# Altium project Cuttomized_Industrial_controller.PrjPcb
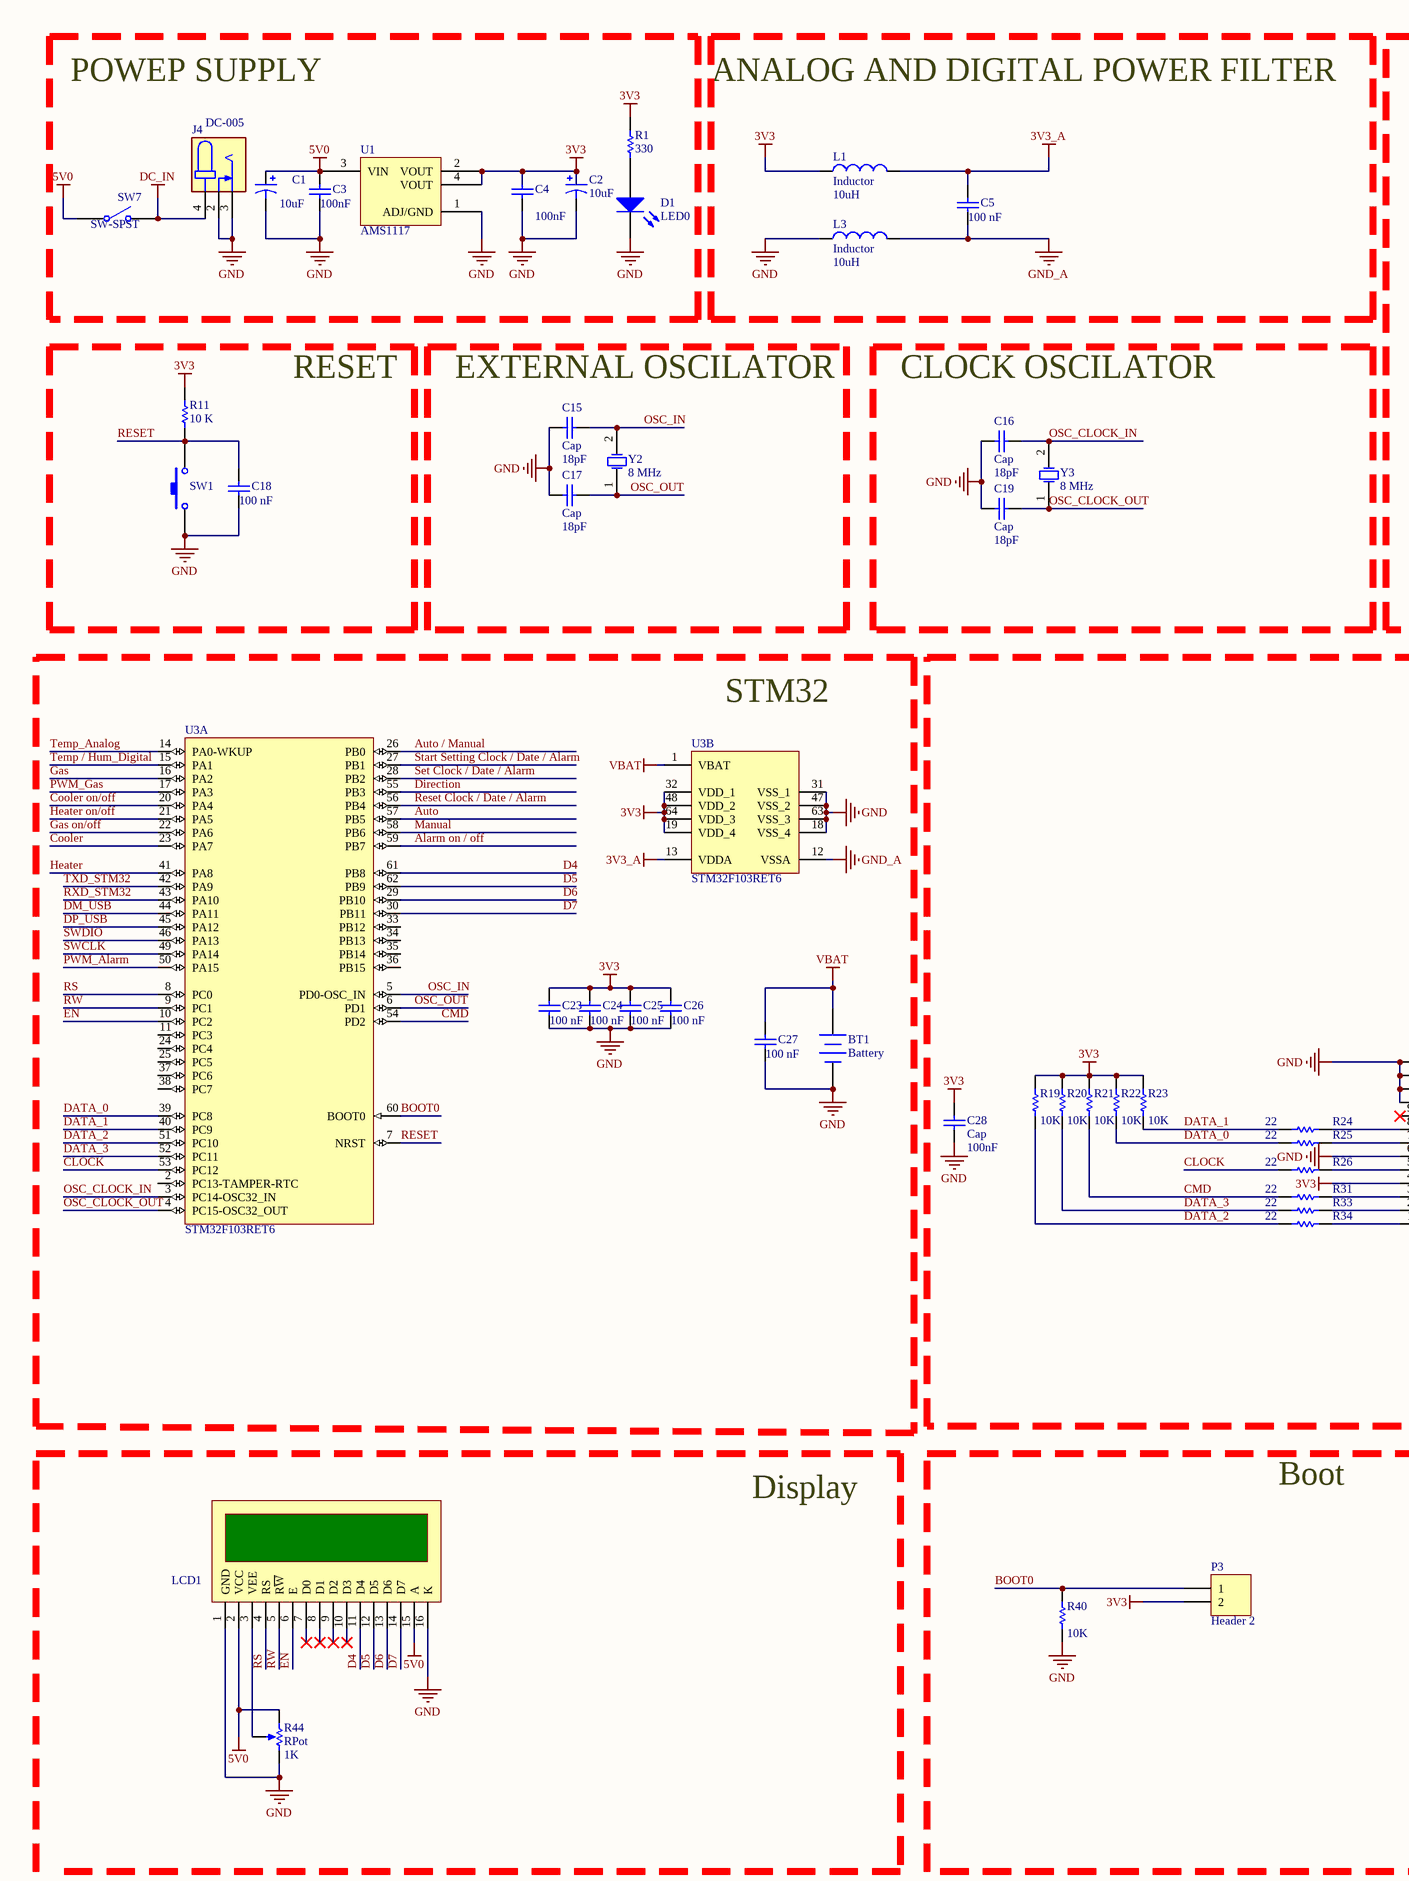
[diagram p0: Cuttomized_Industrial_controller.SchDoc, left]
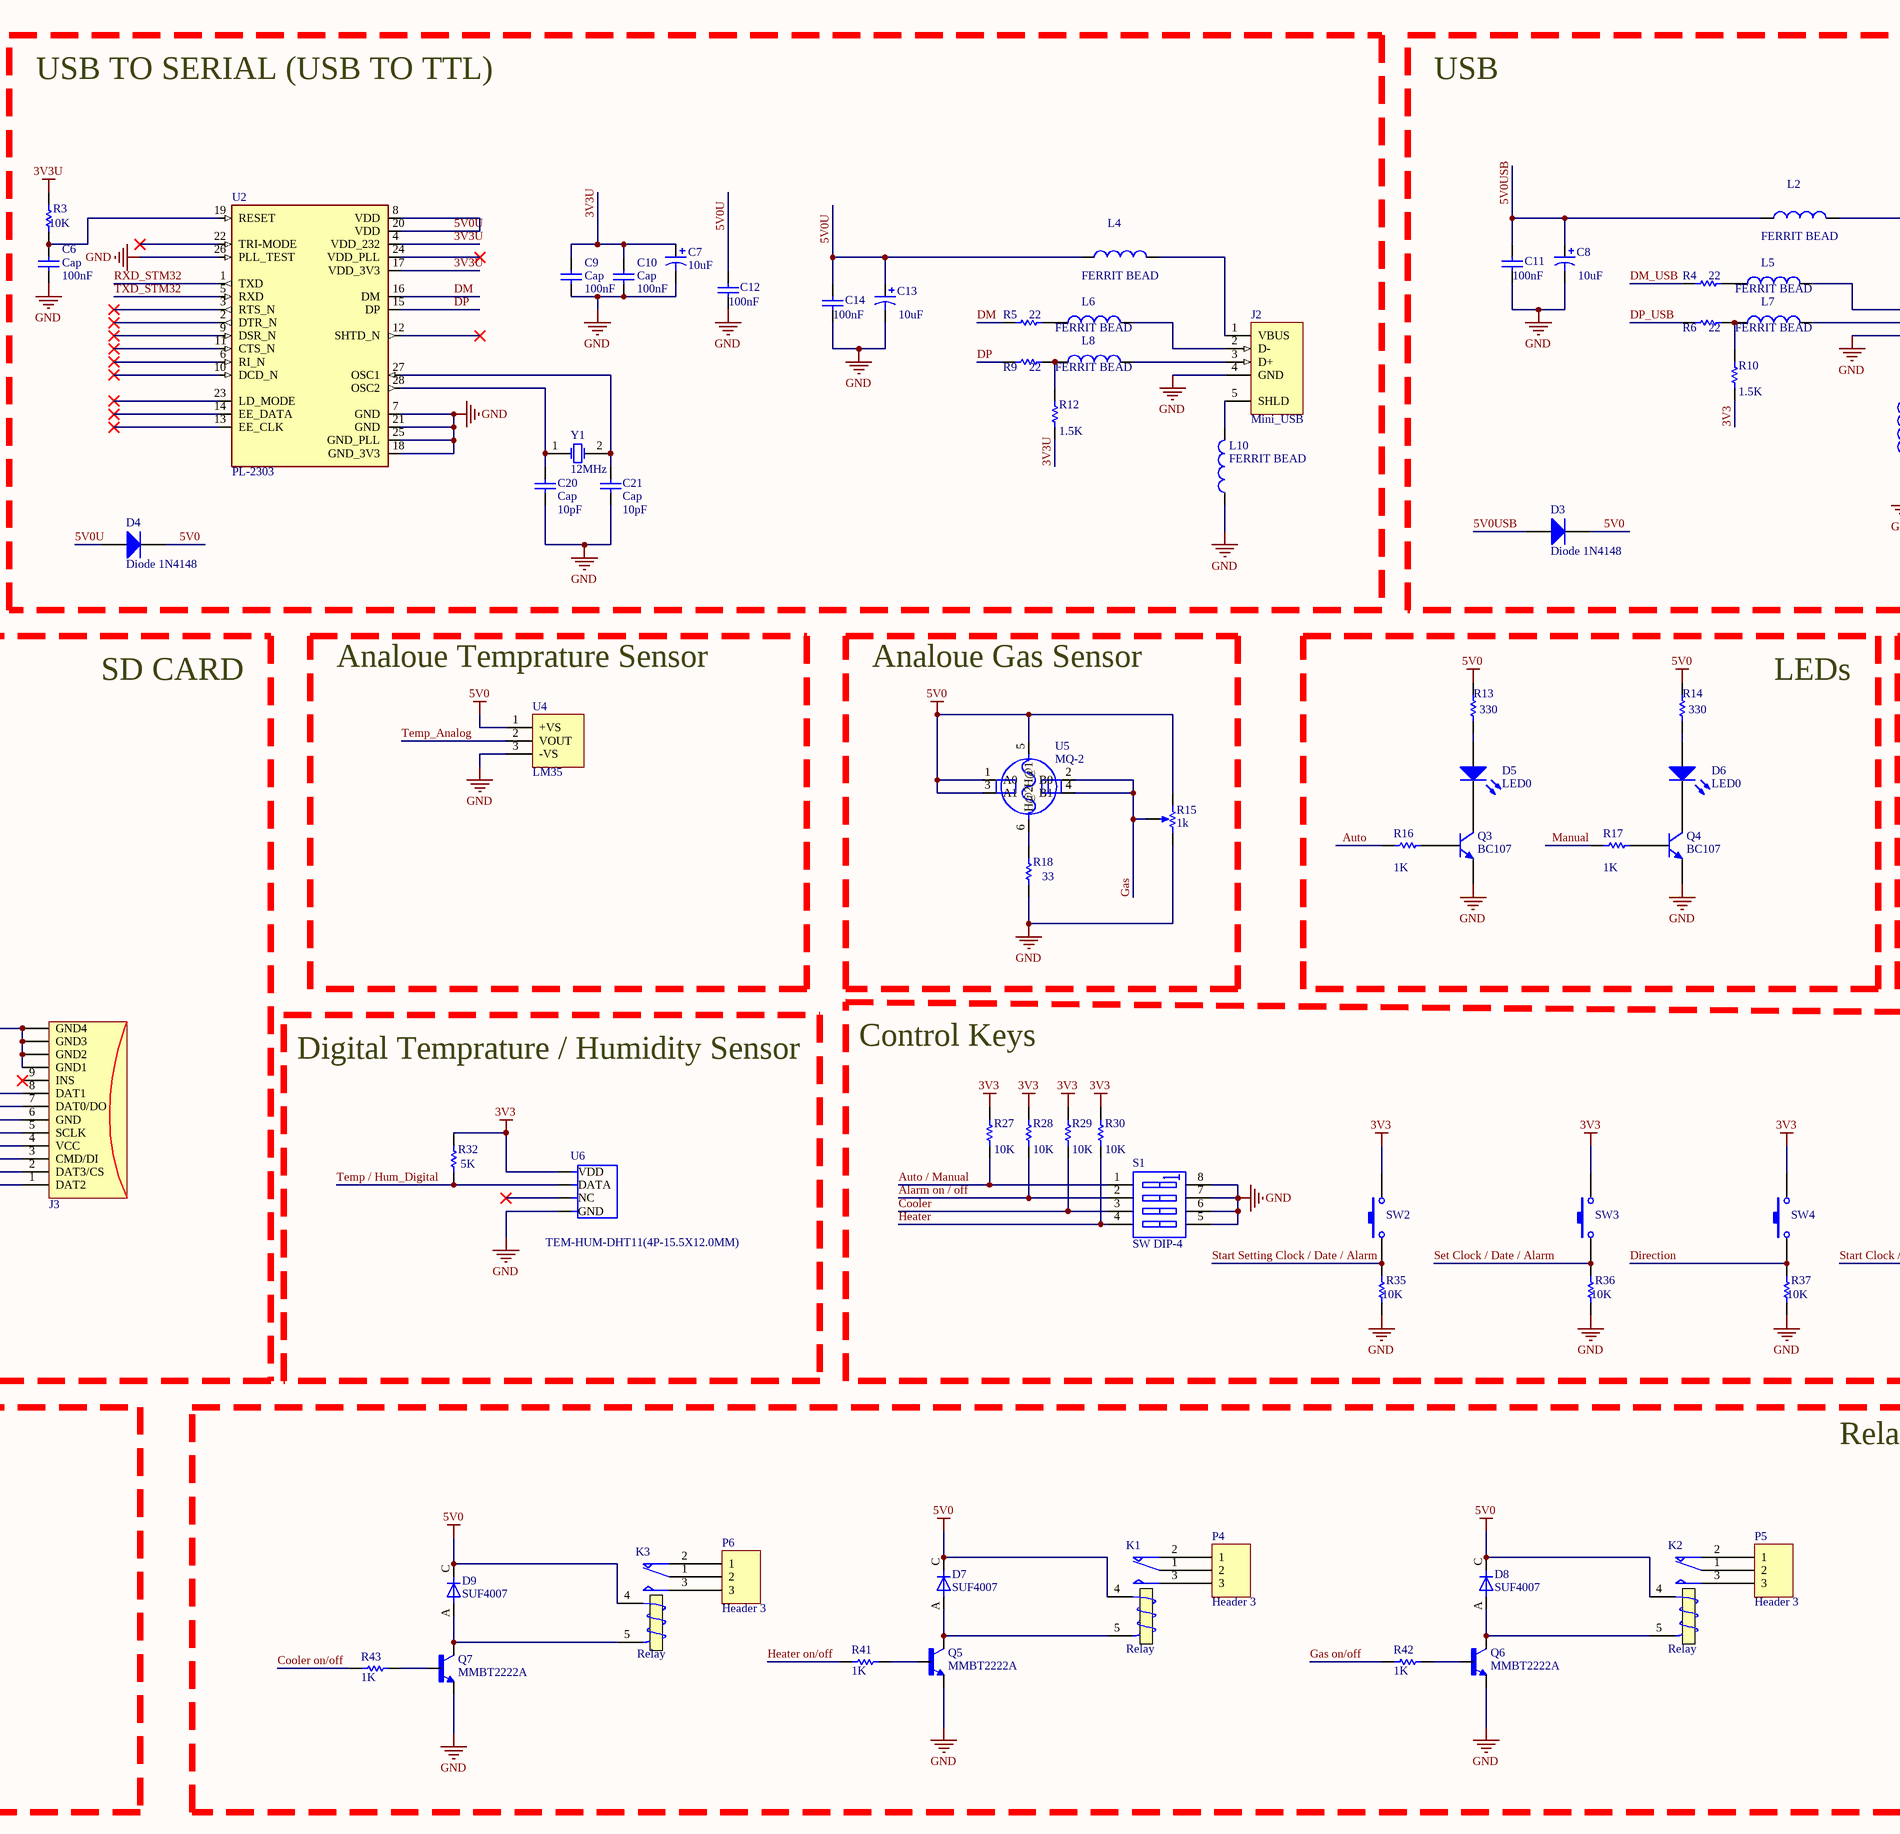
[diagram p1: Cuttomized_Industrial_controller.SchDoc, middle]
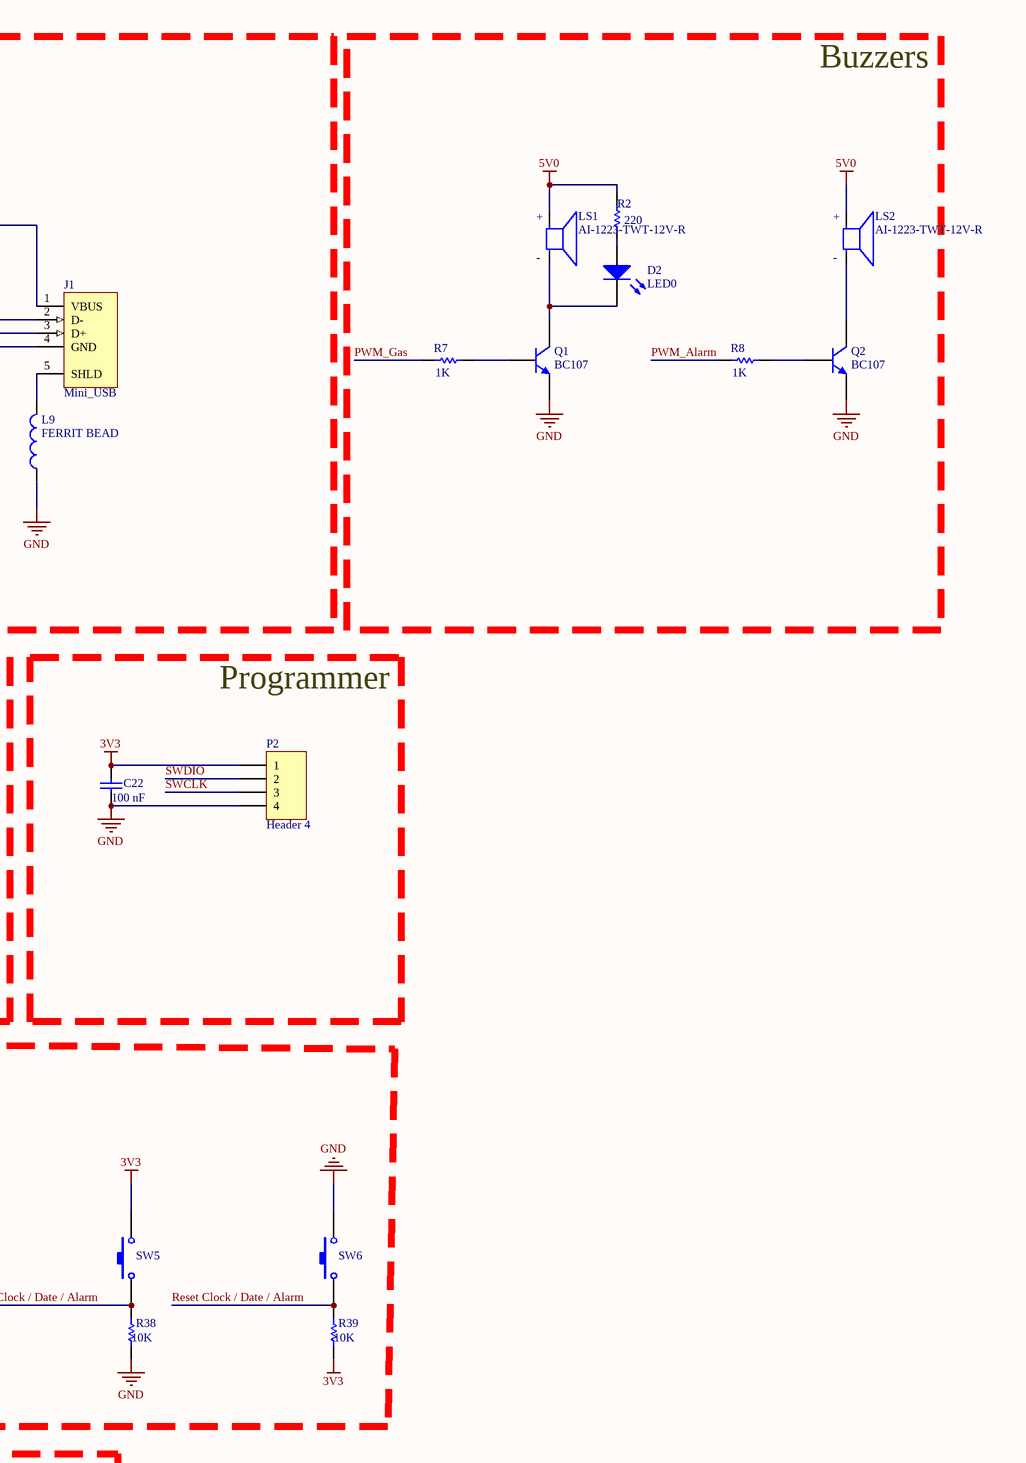
[diagram p2: Cuttomized_Industrial_controller.SchDoc, right]
1 sheet, 131 parts. Net scope: global (net labels, ports and power ports of the same name join across sheets).
Board file: Cuttomized_Industrial_controller.PcbDoc

## Sheet Cuttomized_Industrial_controller.SchDoc
size D; SheetNumber: 1; SheetTotal: 1; SPICEModelCacheBRBSMZFC: <root> / <DocumentId>BRBSMZFC</DocumentId> / <CacheFrame Number="0"> / <Model Name="spdtrelay" Kind="CKT"> / <Text>*Generic SPDT Relay / *Connections:     COM / *                 | NC / *                 | | NO / *                 | | | T1 / *                 | | | | T2 / *                 | | | | | / .SUBCKT SPDTRELAY 1 2 3 4 5 / + PARAMS: PULLIN=4 DROPOFF=0.1 CONTACT=1m RESISTANCE=500 INDUCTANCE=10m / L1 4 6 {(INDUCTANCE/2)} / L2 5 7 {(INDUCTANCE/2)} / R1 6 7 {RESISTANCE} / BNO 8 0 V={PULLIN}-abs(v(6,7)) / SW1 2 1 8 0 SWNC ON / BNC 9 0 V=abs(v(6,7)) / SW2 3 1 9 0 SWNO OFF / .MODEL SWNC SW(VT={DROPOFF} RON={CONTACT} ) / .MODEL SWNO SW(VT={(PULLIN*0.98)} RON={CONTACT} ) / .ENDS SPDTRELAY</Text> / </Model> / <Model Name="dpsw4" Kind="CKT"> / <Text>* DIP switch 4 / * jjt 20/6/2002: created / * / *             Switch connections: / *             sw1 / *             |  |  sw2 / *             |  |  |  |  sw3 / *             |  |  |  |  |  |   sw4 / *             |  |  |  |  |  |  |   | / *             |  |  |  |  |  |  |   | / .subckt dpsw4 1  2  4  5  7  8  10  11 / + PARAMS: STATE1=0 STATE2=0 STATE3=0 STATE4=0 RON=1m ROFF=100E6 / * / V1 3  0 {STATE1} / V2 6  0 {STATE2} / V3 9  0 {STATE3} / V4 12 0 {STATE4} / * / SDIP1 1  2  3  0 DIPMOD / SDIP2 4  5  6  0 DIPMOD / SDIP3 7  8  9  0 DIPMOD / SDIP4 10 11 12 0 DIPMOD / * / .MODEL DIPMOD SW(VT=0.5 RON={RON} ROFF={ROFF}) / .ends dpsw4</Text> / </Model> / </CacheFrame> / </root>

### Parts
BT1  Battery  [BAT-2]
C1  10uF  [CAP_tantal]
C2  10uF  [CAP_tantal]
C3  value 100nF  [C0805]
C4  value 100nF  [C0805]
C5  value 100 nF  [C0805]
C6  Cap  value 100nF  [C0805]
C7  10uF  [CAP_tantal]
C8  10uF  [CAP_tantal]
C9  Cap  value 100nF  [C0805]
C10  Cap  value 100nF  [C0805]
C11  value 100nF  [C0805]
C12  value 100nF  [C0805]
C13  10uF  [CAP_tantal]
C14  value 100nF  [C0805]
C15  Cap  value 18pF  [C0805]
C16  Cap  value 18pF  [C0805]
C17  Cap  value 18pF  [C0805]
C18  value 100 nF  [C0805]
C19  Cap  value 18pF  [C0805]
C20  Cap  value 10pF  [C0805]
C21  Cap  value 10pF  [C0805]
C22  value 100 nF  [C0805]
C23  value 100 nF  [C0805]
C24  value 100 nF  [C0805]
C25  value 100 nF  [C0805]
C26  value 100 nF  [C0805]
C27  value 100 nF  [C0805]
C28  Cap  value 100nF  [C0805]
D1  LED0  [C0805]
D2  LED0  [C0805]
D3  Diode 1N4148  [SOD-123]
D4  Diode 1N4148  [SOD-123]
D5  LED0  [C0805]
D6  LED0  [C0805]
D7  SUF4007  [DIOMELF5025N]
D8  SUF4007  [DIOMELF5025N]
D9  SUF4007  [DIOMELF5025N]
J1  Mini_USB  [USB_mini]
J2  Mini_USB  [USB_mini]
J3  MMC-uSD  [SD-MicroSD_1]  (value not drawn)
J4  DC-005  [NINIGI_DC-005]
K1  Relay  [Relay 5A]
K2  Relay  [Relay 5A]
K3  Relay  [Relay 5A]
L1  Inductor  value 10uH  [C0805]
L2  FERRIT BEAD  [C0805]
L3  Inductor  value 10uH  [C0805]
L4  FERRIT BEAD  [C0805]
L5  FERRIT BEAD  [C0805]
L6  FERRIT BEAD  [C0805]
L7  FERRIT BEAD  [C0805]
L8  FERRIT BEAD  [C0805]
L9  FERRIT BEAD  [C0805]
L10  FERRIT BEAD  [C0805]
LCD1  LCD2x16  [LCD 2*16]  (value not drawn)
LS1  AI-1223-TWT-12V-R  [XDCR_AI-1223-TWT-12V-R]
LS2  AI-1223-TWT-12V-R  [XDCR_AI-1223-TWT-12V-R]
P2  Header 4  [HDR1X4]
P3  Header 2  [HDR1X2]
P4  Header 3  [phoenix terminal 3]
P5  Header 3  [phoenix terminal 3]
P6  Header 3  [phoenix terminal 3]
Q1  BC107  [SOT23]
Q2  BC107  [SOT23]
Q3  BC107  [SOT23]
Q4  BC107  [SOT23]
Q5  MMBT2222A  [SOT23]
Q6  MMBT2222A  [SOT23]
Q7  MMBT2222A  [SOT23]
R1  330  [C0805]
R2  value 220  [C0805]
R3  value 10K  [C0805]
R4  value 22  [C0805]
R5  value 22  [C0805]
R6  value 22  [C0805]
R7  value 1K  [C0805]
R8  value 1K  [C0805]
R9  value 22  [C0805]
R10  value 1.5K  [C0805]
R11  10 K  [C0805]
R12  value 1.5K  [C0805]
R13  value 330  [C0805]
R14  value 330  [C0805]
R15  1k  [Multi-Turn]
R16  value 1K  [C0805]
R17  value 1K  [C0805]
R18  value 33  [C0805]
R19  value 10K  [C0805]
R20  value 10K  [C0805]
R21  value 10K  [C0805]
R22  value 10K  [C0805]
R23  value 10K  [C0805]
R24  value 22  [C0805]
R25  value 22  [C0805]
R26  value 22  [C0805]
R27  value 10K  [C0805]
R28  value 10K  [C0805]
R29  value 10K  [C0805]
R30  value 10K  [C0805]
R31  value 22  [C0805]
R32  value 5K  [C0805]
R33  value 22  [C0805]
R34  value 22  [C0805]
R35  value 10K  [C0805]
R36  value 10K  [C0805]
R37  value 10K  [C0805]
R38  value 10K  [C0805]
R39  value 10K  [C0805]
R40  value 10K  [C0805]
R41  value 1K  [C0805]
R42  value 1K  [C0805]
R43  value 1K  [C0805]
R44  RPot  value 1K  [Multi-Turn]
S1  SW DIP-4  [dip switch x4]
SW1  ?  [Sw_Tact 2PIN]  (value not drawn)
SW2  ?  [Sw_Tact 2PIN]  (value not drawn)
SW3  ?  [Sw_Tact 2PIN]  (value not drawn)
SW4  ?  [Sw_Tact 2PIN]  (value not drawn)
SW5  ?  [Sw_Tact 2PIN]  (value not drawn)
SW6  ?  [Sw_Tact 2PIN]  (value not drawn)
SW7  SW-SPST  [DSW 1]
U1  AMS1117  [SOT223_L]
U2  PL-2303  [SOP65P780X200-28N]
U3  STM32F103RET6  [LQFP64]  (parts A,B of 2)
U4  LM35  [TO-92]
U5  MQ-2  [SNR6-D19.0MM]
U6  TEM-HUM-DHT11(4P-15.5X12.0MM)  [SNR4-2.54-15.5X12.0X5.5MM]
Y1  12MHz  [Xtal]
Y2  8 MHz  [Xtal]
Y3  8 MHz  [Xtal]

### Blocks framed on the sheet
POWEP SUPPLY: C1-C4 D1 J4 R1 SW7 U1
ANALOG AND DIGITAL POWER FILTER: C5 L1 L3
USB TO SERIAL (USB TO TTL): C6 C7 C9 C10 C12-C14 C20 C21 D4 J2 L4 L6 L8 L10 R3 R5 R9 R12 U2 Y1
USB: C8 C11 D3 J1 L2 L5 L7 L9 R4 R6 R10
Buzzers: D2 LS1 LS2 Q1 Q2 R2 R7 R8
RESET: C18 R11 SW1
EXTERNAL OSCILATOR: C15 C17 Y2
CLOCK OSCILATOR: C16 C19 Y3
STM32: BT1 C23-C27 U3
SD CARD: C28 J3 R19-R26 R31 R33 R34
Analoue Gas Sensor: R15 R18 U5
LEDs: D5 D6 Q3 Q4 R13 R14 R16 R17
Programmer: C22 P2
Digital Temprature / Humidity Sensor: R32 U6
Control Keys: R27-R30 R35-R39 S1 SW2-SW6
Boot: P3 R40
Relays: D7-D9 K1-K3 P4-P6 Q5-Q7 R41-R43

### Nets
3V3: C2.2 C4.2 C22.2 C23.2 C24.2 C25.2 C26.2 C28.2 J3.4(VCC) L1.1 P2.1 P3.2 R1.2 R10.2 R11.2 R19.1 R20.1 R21.1 R22.1 R23.1 R27.1 R28.1 R29.1 R30.1 R32.2 R39.2 SW2.2 SW3.2 SW4.2 SW5.2 U1.2(VOUT) U1.4(VOUT) U3.19(VDD_4) U3.32(VDD_1) U3.48(VDD_2) U3.64(VDD_3) U6.1(VDD)
3V3_A: C5.2 L1.2 U3.13(VDDA)
3V3U: C7.2 C9.2 C10.2 R3.1 R12.2 U2.4(VDD_232) U2.17(VDD_3V3)
5V0: C1.2 C3.2 D3.2(K) D4.2(K) D7.C D8.C D9.C K1.4(T1) K2.4(T1) K3.4(T1) LCD1.2(VCC) LCD1.15(A) LS1.P(POS) LS2.P(POS) R2.1 R13.1 R14.1 R15.1(TOP) R44.1(TOP) SW7.1(COMMON) U1.3(VIN) U4.1(+VS) U5.1(A0) U5.3(A1) U5.5(H@1)
DC_IN: J4.4 SW7.2(NO)
GND: BT1.2(-) C1.1 C2.1 C3.1 C4.1 C6.1 C7.1 C8.1 C9.1 C10.1 C11.1 C12.1 C13.1 C14.1 C15.1 C16.1 C17.1 C18.1 C19.1 C20.1 C21.1 C22.1 C23.1 C24.1 C25.1 C26.1 C27.1 C28.1 D1.2(K) J1.4(GND) J2.4(GND) J3.6(GND) J3.SH1(GND1) J3.SH2(GND2) J3.SH3(GND3) J3.SH4(GND4) J4.2 J4.3 L3.1 L9.1 L10.1 LCD1.1(GND) LCD1.16(K) P2.4 Q1.1(B) Q2.1(B) Q3.1(E) Q4.1(E) Q5.2(E) Q6.2(E) Q7.2(E) R15.3(BOT) R18.1 R35.2 R36.2 R37.2 R38.2 R40.2 R44.2(BOT) S1.5(B4) S1.6(B3) S1.7(B2) S1.8(B1) SW1.1 SW6.2 U1.1(ADJ/GND) U2.7(GND) U2.18(GND_3V3) U2.21(GND) U2.25(GND_PLL) U2.26(PLL_TEST) U3.18(VSS_4) U3.31(VSS_1) U3.47(VSS_2) U3.63(VSS_3) U4.3(-VS) U6.4(GND)
GND_A: C5.1 L3.2 U3.12(VSSA)
VBAT: BT1.1(+) C27.2 U3.1(VBAT)
5V0U: C12.2 C13.2 C14.2 D4.1(A) L4.1 U2.8(VDD) U2.20(VDD)
5V0USB: C8.2 C11.2 D3.1(A) L2.1
Alarm on / off: R28.2 S1.2(A2) U3.59(PB7)
Auto: R16.1 U3.57(PB5)
Auto / Manual: R27.2 S1.1(A1) U3.26(PB0)
BOOT0: P3.1 R40.1 U3.60(BOOT0)
CLOCK: R26.1 U3.53(PC12)
CMD: R21.2 R31.1 U3.54(PD2)
Cooler: R29.2 S1.3(A3) U3.23(PA7)
Cooler on/off: R43.1 U3.20(PA4)
D4: LCD1.11(D4) U3.61(PB8)
D5: LCD1.12(D5) U3.62(PB9)
D6: LCD1.13(D6) U3.29(PB10)
D7: LCD1.14(D7) U3.30(PB11)
DATA_0: R22.2 R25.1 U3.39(PC8)
DATA_1: R23.2 R24.1 U3.40(PC9)
DATA_2: R19.2 R34.1 U3.51(PC10)
DATA_3: R20.2 R33.1 U3.52(PC11)
Direction: R37.1 SW4.1 U3.55(PB3)
DM: R5.2 U2.16(DM)
DM_USB: R4.2 U3.44(PA11)
DP: R9.2 U2.15(DP)
DP_USB: R6.2 U3.45(PA12)
EN: LCD1.6(E) U3.10(PC2)
Gas: R15.2(TAP) U3.16(PA2) U5.2(B0) U5.4(B1)
Gas on/off: R42.1 U3.22(PA6)
Heater: R30.2 S1.4(A4) U3.41(PA8)
Heater on/off: R41.1 U3.21(PA5)
Manual: R17.1 U3.58(PB6)
OSC_CLOCK_IN: C16.2 U3.3(PC14-OSC32_IN) Y3.2(OSC2)
OSC_CLOCK_OUT: C19.2 U3.4(PC15-OSC32_OUT) Y3.1(OSC1)
OSC_IN: C15.2 U3.5(PD0-OSC_IN) Y2.2(OSC2)
OSC_OUT: C17.2 U3.6(PD1) Y2.1(OSC1)
PWM_Alarm: R8.2 U3.50(PA15)
PWM_Gas: R7.2 U3.17(PA3)
RESET: C18.2 R11.1 SW1.2 U3.7(NRST)
Reset Clock / Date / Alarm: R39.1 SW6.1 U3.56(PB4)
RS: LCD1.4(RS) U3.8(PC0)
RW: LCD1.5(R~{W}) U3.9(PC1)
RXD_STM32: U2.1(TXD) U3.43(PA10)
Set Clock / Date / Alarm: R36.1 SW3.1 U3.28(PB2)
Start Clock / Date / Alarm: R38.1 SW5.1
Start Setting Clock / Date / Alarm: R35.1 SW2.1 U3.27(PB1)
SWCLK: P2.3 U3.49(PA14)
SWDIO: P2.2 U3.46(PA13)
Temp / Hum_Digital: R32.1 U3.15(PA1) U6.2(DATA)
Temp_Analog: U3.14(PA0-WKUP) U4.2(VOUT)
TXD_STM32: U2.5(RXD) U3.42(PA9)
NetC6_2: C6.2 R3.2 U2.19(RESET)
NetC20_2: C20.2 U2.28(OSC2) Y1.1(OSC1)
NetC21_2: C21.2 U2.27(OSC1) Y1.2(OSC2)
NetD1_1: D1.1(A) R1.1
NetD2_1: D2.1(A) R2.2
NetD2_2: D2.2(K) LS1.N(NEG) Q1.3(C)
NetD5_1: D5.1(A) R13.2
NetD5_2: D5.2(K) Q3.3(C)
NetD6_1: D6.1(A) R14.2
NetD6_2: D6.2(K) Q4.3(C)
NetD7_A: D7.A K1.5(T2) Q5.3(C)
NetD8_A: D8.A K2.5(T2) Q6.3(C)
NetD9_A: D9.A K3.5(T2) Q7.3(C)
NetJ1_1: J1.1(VBUS) L2.2
NetJ1_2: J1.2(D-) L5.2
NetJ1_3: J1.3(D+) L7.2
NetJ1_5: J1.5(SHLD) L9.2
NetJ2_1: J2.1(VBUS) L4.2
NetJ2_2: J2.2(D-) L6.2
NetJ2_3: J2.3(D+) L8.2
NetJ2_5: J2.5(SHLD) L10.2
NetJ3_1: J3.1(DAT2) R34.2
NetJ3_2: J3.2(DAT3/CS) R33.2
NetJ3_3: J3.3(CMD/DI) R31.2
NetJ3_5: J3.5(SCLK) R26.2
NetJ3_7: J3.7(DAT0/DO) R25.2
NetJ3_8: J3.8(DAT1) R24.2
NetK1_1: K1.1(COM) P4.2
NetK1_2: K1.2(NC) P4.1
NetK1_3: K1.3(NO) P4.3
NetK2_1: K2.1(COM) P5.2
NetK2_2: K2.2(NC) P5.1
NetK2_3: K2.3(NO) P5.3
NetK3_1: K3.1(COM) P6.2
NetK3_2: K3.2(NC) P6.1
NetK3_3: K3.3(NO) P6.3
NetL5_1: L5.1 R4.1
NetL6_1: L6.1 R5.1
NetL7_1: L7.1 R6.1 R10.1
NetL8_1: L8.1 R9.1 R12.1
NetLCD1_3: LCD1.3(VEE) R44.3(TAP)
NetLS2_N: LS2.N(NEG) Q2.3(C)
NetQ1_2: Q1.2(E) R7.1
NetQ2_2: Q2.2(E) R8.1
NetQ3_2: Q3.2(B) R16.2
NetQ4_2: Q4.2(B) R17.2
NetQ5_1: Q5.1(B) R41.2
NetQ6_1: Q6.1(B) R42.2
NetQ7_1: Q7.1(B) R43.2
NetR18_2: R18.2 U5.6(H@2)

Not connected (* = marked no-connect by the designer): J3 9(INS)*; LCD1 7(D0)* 8(D1)* 9(D2)* 10(D3)*; U2 2(DTR_N)* 3(RTS_N)* 6(RI_N)* 9(DSR_N)* 10(DCD_N)* 11(CTS_N)* 12(SHTD_N)* 13(EE_CLK)* 14(EE_DATA)* 22(TRI-MODE)* 23(LD_MODE)* 24(VDD_PLL)*; U3 2(PC13-TAMPER-RTC) 11(PC3) 24(PC4) 25(PC5) 33(PB12) 34(PB13) 35(PB14) 36(PB15) 37(PC6) 38(PC7); U6 3(NC)*

### Notes on the sheet
- Analoue Temprature Sensor
- Display
- (in symbol AI-1223-TWT-12V-R) +; -

### Library data of the parts
BT1 = Battery: Multicell Battery; Published: 24-Mar-1999; LatestRevisionDate: 17-Jul-2002; LatestRevisionNote: Re-released for DXP Platform.; PackageReference: BAT-2; Publisher: Altium Limited
C1 C2 C7 C8 C13 = Cap Elec: Capacitor
C3-C5 = Cap Semi: Capacitor (Semiconductor SIM Model); Published: 8-Jun-2000; LatestRevisionDate: 29-May-2009; LatestRevisionNote: IPC-7351 Footprint Added.; PackageReference: C1206; Publisher: Altium Limited; PackageDescription: Chip Capacitor
C6 C9-C12 C14-C28 = Cap: Capacitor; Published: 8-Jun-2000; LatestRevisionDate: 17-Jul-2002; LatestRevisionNote: Re-released for DXP Platform.; PackageReference: RAD-0.3; Publisher: Altium Limited; PackageDescription: Radial Cap, Thru-Hole; 2 Leads; 0.3 in Pin Spacing
D1 D2 D5 D6 = LED0: Typical INFRARED GaAs LED; Published: 8-Jun-2000; LatestRevisionDate: 08-Jul-2005; LatestRevisionNote: Mech Layer 1 removed.; PackageReference: LED-0; Publisher: Altium Limited; PackageDescription: LED; 2 Leads
D3 D4 = Diode 1N4148: High Conductance Fast Diode; Published: 8-Jun-2000; LatestRevisionDate: 17-Jul-2002; LatestRevisionNote: Re-released for DXP Platform.; DatasheetVersion: 1997; PackageReference: DO-35; Publisher: Altium Limited; PackageDescription: Diode, Axial; Body 3.8 x 1.9 mm (LxDia. max), Lead Dia. 0.53 mm (max); Code_JEDEC: DO-204-AH; ComponentLink1Description: Manufacturer Link; ComponentLink1URL: http://www.fairchildsemi.com/; ComponentLink2Description: Datasheet; ComponentLink2URL: http://www.fairchildsemi.com/ds/1N%2F1N4148.pdf
D7-D9 = SUF4007: Diode Switching 1KV 1A Automotive 2-Pin MELF; MF: Diotec; SnapEDA_Link: https://www.snapeda.com/parts/SUF4007/Diotec/view-part/423373/?ref=snap; Value: *; Availability: Unavailable; Price: None; MP: SUF4007; Package: DO-213 Diotec
J1 J2 = USB_Mini: USB 2.0, Right Angle, SMT, B Type, Receptacle, 5 Position, Black; ContactMaterial: Copper Alloy; ContactPlating: Gold (30); PCB_Layout: Complies with manufacturer's recommendation.; DrillSize: Corresponds to nominal value.; PanelGround: Without; Published: 15-Jul-2004; DatasheetDocument: 27-Jun-2003; PackageDocument: 27-Jun-2003; PackageReference: 440247; Publisher: Altium Limited; HousingMaterial: Thermoplastic; ComponentLink1Description: Manufacturer Link; ComponentLink1URL: http://www.tycoelectronics.com/; ComponentLink2Description: Packaging Specification; ComponentLink2URL: http://ecommas.tycoelectronics.com/commerce/DocumentDelivery/DDEController?Action=showdoc&DocId=Customer+Drawing%7F440247%7FD%7Fpdf%7FEnglish%7FC_440247_D.pdf
J3 = MMC-uSD: uSD/MMC Socket
J4 = DC-005: DC Jack; Package: None; Availability: Unavailable; Value: *; MP: DC-005; Price: None
K1-K3 = Relay: SPDT Relay; Published: 8-Jun-2000; LatestRevisionDate: 17-Jul-2002; LatestRevisionNote: Re-released for DXP Platform.; PackageReference: MODULE5B; Publisher: Altium Limited
L1-L10 = Inductor: Code_IEC: 1005; Published: 8-Jun-2000; LatestRevisionDate: 29-May-2009; LatestRevisionNote: IPC-7351 Footprint Added.; PackageReference: 0402-A; Publisher: Altium Limited; PackageDescription: Chip Inductor; Code_JEITA: 0402
LS1 LS2 = AI-1223-TWT-12V-R: ELECTRO-MECHANICAL AUDIO INDICATOR; MF: PUI Audio,; Availability: In Stock; Package: 2225 PUI Audio; Value: *; Price: None; MP: AI-1223-TWT-12V-R; Purchase-URL: https://pricing.snapeda.com/search/part/AI-1223-TWT-12V-R/?ref=eda
P2 = Header 4: Header, 4-Pin; LatestRevisionDate: 17-Jul-2002; LatestRevisionNote: Re-released for DXP Platform.; Publisher: Altium Limited
P3 = Header 2: Header, 2-Pin; LatestRevisionDate: 17-Jul-2002; LatestRevisionNote: Re-released for DXP Platform.; Publisher: Altium Limited
P4-P6 = Header 3: Header, 3-Pin; LatestRevisionDate: 17-Jul-2002; LatestRevisionNote: Re-released for DXP Platform.; Publisher: Altium Limited
Q5-Q7 = MMBT2222A: Bipolar _BJT_ Transistor NPN 40V 600mA 270MHz 350mW Surface Mount SOT-23-3; MF: STMicroelectronics; Package: TO-236-3 Taitron; Availability: Unavailable; MP: MMBT2222A; Value: *; SnapEDA_Link: https://www.snapeda.com/parts/MMBT2222A/STMicroelectronics/view-part/1642048/?ref=snap; Price: None
R1 R11 = RES
R2-R10 R12-R14 R16-R43 = Res Semi: Semiconductor Resistor; Published: 8-Jun-2000; LatestRevisionDate: 17-Jul-2002; LatestRevisionNote: Re-released for DXP Platform.; PackageReference: AXIAL-0.5; Publisher: Altium Limited; PackageDescription: Axial Device, Thru-Hole; 2 Leads; 0.5 in Pin Spacing
R15 = POT: Potentiometer
R44 = RPot: Potentiometer; Sim Note: Enter the Resistance value and the set point into parameter fields.; Set Position: 0.5; Published: 8-Jun-2000; LatestRevisionDate: 17-Jul-2002; LatestRevisionNote: Re-released for DXP Platform.; PackageReference: VR5; Publisher: Altium Limited; PackageDescription: Variable Resistor, Thru-Hole; 3 Leads
S1 = SW DIP-4: DIP Switch, 4 Position, SPST; Published: 24-Mar-1999; LatestRevisionDate: 29-May-2009; LatestRevisionNote: IPC-7351 Footprint Added.; PackageVersion: Dec-2002; PackageReference: SO8; Publisher: Altium Limited; PackageDescription: 8-Pin Small Outline Integrated Circuit 1.27 mm Pitch; Code_JEDEC: MS-012-AA; Code_IPC: SOIC127P600-8
SW1-SW6 = Micro Switch
SW7 = SW-SPST: Single-Pole, Single-Throw Switch; Published: 24-Mar-1999; LatestRevisionDate: 17-Jul-2002; LatestRevisionNote: Re-released for DXP Platform.; PackageReference: SPST-2; Publisher: Altium Limited; PackageDescription: Switch; 2 Leads
U2 = PL-2303: USB to Serial Bridge Controller; MF: Prolific Technology; Package: None; MP: PL-2303; Value: *; Availability: Unavailable; SnapEDA_Link: https://www.snapeda.com/parts/PL-2303/Prolific%20Technology/view-part/598560/?ref=snap; Price: None
U3 = STM32F103RET6: STM32 ARM-based 32-bit MCU Performance Line with 512 kB Flash, 64 kB Internal RAM, -40 to +85°C Temperature, 64-Pin LQFP, Tray; DatasheetVersion: rev8.0, Apr-2011; PackageVersion: rev13, Apr-2011; PackageReference: LQFP64; PackageDescription: 64-Pin Low-Profile Quad Flat Pack, 10 x 10 mm Body, 0.5 mm Pitch (LQFP64); ComponentLink1Description: Manufacturer URL; ComponentLink1URL: http://www.st.com/; ComponentLink2Description: STM32F103 Datasheet; ComponentLink2URL: http://www.st.com/internet/com/TECHNICAL_RESOURCES/TECHNICAL_LITERATURE/DATASHEET/CD00191185.pdf; ComponentLink3Description: STM32 Family Web Page; ComponentLink3URL: www.st.com/stm32
U5 = DIP-GAS-MQ-2(6P-D19MM): D-Sub MIL Spec Connectors Microminiature Series .050; MF: AirBorn; Availability: In Stock; Purchase-URL: https://pricing.snapeda.com/search/part/MQ-2/?ref=eda; Package: None; SnapEDA_Link: https://www.snapeda.com/parts/MQ-2/AirBorn/view-part/?ref=snap; MP: MQ-2; Check_prices: https://www.snapeda.com/parts/MQ-2/AirBorn/view-part/?ref=eda; Price: None; Value: *
U6 = TEM-HUM-DHT11(4P-15.5X12.0MM): Servo AC 100 ~ 120VAC Supply 10A 120V Load; MP: DHT11; MF: Panasonic Industrial Automation Sales; Package: None; SnapEDA_Link: https://www.snapeda.com/parts/DHT11/Panasonic/view-part/6618018/?ref=snap; Check_prices: https://www.snapeda.com/parts/DHT11/Panasonic/view-part/6618018/?ref=eda; Availability: In Stock; Value: *; Price: None; Purchase-URL: https://pricing.snapeda.com/search/part/DHT11/?ref=eda
Y1 = XTAL: Crystal Oscillator; Published: 8-Jun-2000; LatestRevisionDate: 17-Jul-2002; LatestRevisionNote: Re-released for DXP Platform.; PackageReference: R38; Publisher: Altium Limited; PackageDescription: Crystal, Thru-Hole; 2 Leads; Body 3.1 x 8.2 mm (Dia.xH)
Y2 Y3 = XTAL: 12 MHz; Published: 8-Jun-2000; LatestRevisionDate: 17-Jul-2002; LatestRevisionNote: Re-released for DXP Platform.; PackageReference: R38; Publisher: Altium Limited; PackageDescription: Crystal, Thru-Hole; 2 Leads; Body 3.1 x 8.2 mm (Dia.xH)